# Altium schematic sheet Buttons.SchDoc
size A4; SheetNumber: 4; SheetTotal: 4
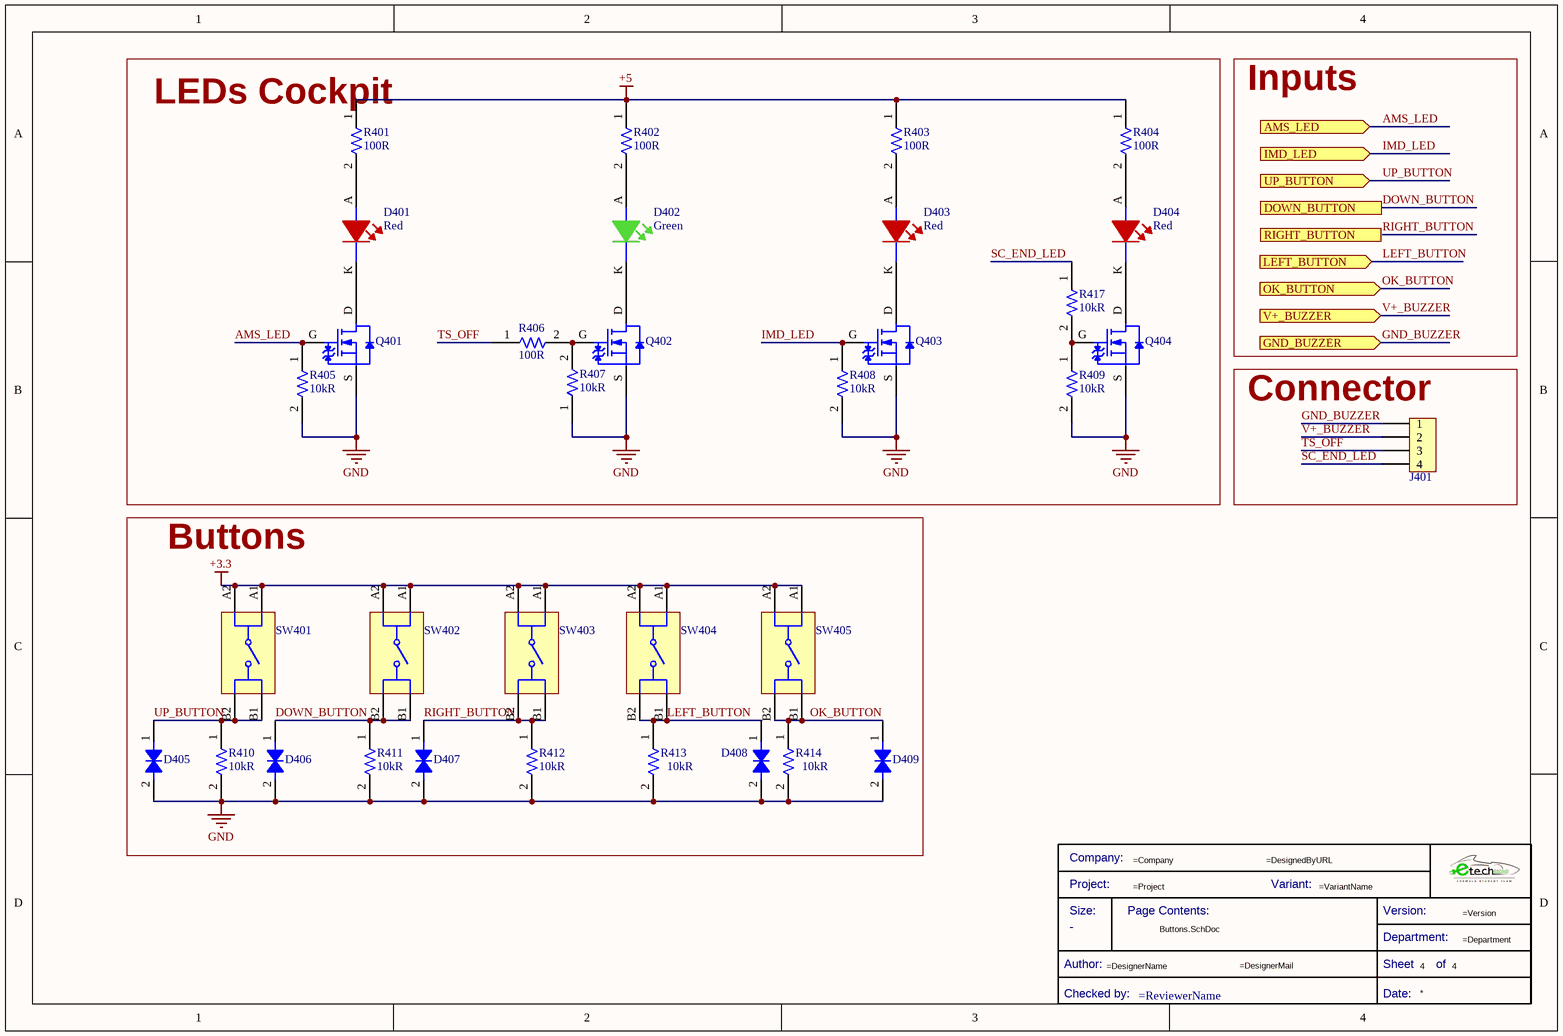
[diagram p0: Buttons.SchDoc]

## Parts
*  Title Block_template  (value not drawn)  (graphical)
D401  Color: Red  [LED-THT/WE/D3.9H10.5]  (hidden comment: 150080RS75000)
D402  Color: Green  [LED-THT/WE/D3.9H10.5]  (hidden comment: 150080GS75000)
D403  Color: Red  [LED-THT/WE/D3.9H10.5]  (hidden comment: 150080RS75000)
D404  Color: Red  [LED-THT/WE/D3.9H10.5]  (hidden comment: 150080RS75000)
D405  824501600  [DTVS-DO-214AC]  (value not drawn)
D406  824501600  [DTVS-DO-214AC]  (value not drawn)
D407  824501600  [DTVS-DO-214AC]  (value not drawn)
D408  824501600  [DTVS-DO-214AC]  (value not drawn)
D409  824501600  [DTVS-DO-214AC]  (value not drawn)
J401  436500400  [J_MicroFit_1x4]  (value not drawn)
Q401  SQ2318BES-T1_GE3  [TRT-NCH-3/35-CPH]  (value not drawn)
Q402  SQ2318BES-T1_GE3  [TRT-NCH-3/35-CPH]  (value not drawn)
Q403  SQ2318BES-T1_GE3  [TRT-NCH-3/35-CPH]  (value not drawn)
Q404  SQ2318BES-T1_GE3  [TRT-NCH-3/35-CPH]  (value not drawn)
R401  Resistance: 100R  [R0805FTK]  (hidden comment: CR0805-FX-1000ELF)
R402  Resistance: 100R  [R0805FTK]  (hidden comment: CR0805-FX-1000ELF)
R403  Resistance: 100R  [R0805FTK]  (hidden comment: CR0805-FX-1000ELF)
R404  Resistance: 100R  [R0805FTK]  (hidden comment: CR0805-FX-1000ELF)
R405  Resistance: 10kR  [R0805FTK]  (hidden comment: CR0805-JW-103ELF)
R406  Resistance: 100R  [R0805FTK]  (hidden comment: CR0805-FX-1000ELF)
R407  Resistance: 10kR  [R0805FTK]  (hidden comment: CR0805-JW-103ELF)
R408  Resistance: 10kR  [R0805FTK]  (hidden comment: CR0805-JW-103ELF)
R409  Resistance: 10kR  [R0805FTK]  (hidden comment: CR0805-JW-103ELF)
R410  Resistance: 10kR  [R0805FTK]  (hidden comment: CR0805-JW-103ELF)
R411  Resistance: 10kR  [R0805FTK]  (hidden comment: CR0805-JW-103ELF)
R412  Resistance: 10kR  [R0805FTK]  (hidden comment: CR0805-JW-103ELF)
R413  Resistance: 10kR  [R0805FTK]  (hidden comment: CR0805-JW-103ELF)
R414  Resistance: 10kR  [R0805FTK]  (hidden comment: CR0805-JW-103ELF)
R417  Resistance: 10kR  [R0805FTK]  (hidden comment: CR0805-JW-104ELF)
SW401  430456073736  [SWITCH_12x12/4304x60737x6]  (value not drawn)
SW402  430456073736  [SWITCH_12x12/4304x60737x6]  (value not drawn)
SW403  430456073736  [SWITCH_12x12/4304x60737x6]  (value not drawn)
SW404  430456073736  [SWITCH_12x12/4304x60737x6]  (value not drawn)
SW405  430456073736  [SWITCH_12x12/4304x60737x6]  (value not drawn)

## Blocks framed on the sheet
LEDs Cockpit: D401-D404 Q401-Q404 R401-R409 R417
Connector: J401
Buttons: D405-D409 R410-R414 SW401-SW405

## Ports
AMS_LED (in, see DASHBOARD[1C]), DOWN_BUTTON (in, see DASHBOARD[1C]), GND_BUZZER (in, see DASHBOARD[1C]), IMD_LED (in, see DASHBOARD[1C]), LEFT_BUTTON (in, see DASHBOARD[1C]), OK_BUTTON (in, see DASHBOARD[1C]), RIGHT_BUTTON (in, see DASHBOARD[1C]), UP_BUTTON (in, see DASHBOARD[1C]), V+_BUZZER (in, see DASHBOARD[1C])

## Nets
+3.3: SW401.A1 SW401.A2 SW402.A1 SW402.A2 SW403.A1 SW403.A2 SW404.A1 SW404.A2 SW405.A1 SW405.A2
+5: R401.1 R402.1 R403.1 R404.1
GND: D405.2 D406.2 D407.2 D408.2 D409.2 Q401.S Q402.S Q403.S Q404.S R405.2 R407.1 R408.2 R409.2 R410.2 R411.2 R412.2 R413.2 R414.2
AMS_LED: Q401.G R405.1 ; port AMS_LED
DOWN_BUTTON: D406.1 R411.1 SW402.B1 SW402.B2
GND_BUZZER: J401.1 ; port GND_BUZZER
IMD_LED: Q403.G R408.1 ; port IMD_LED
LEFT_BUTTON: D408.1 R413.1 SW404.B1 SW404.B2 ; port LEFT_BUTTON
OK_BUTTON: D409.1 R414.1 SW405.B1 SW405.B2 ; port OK_BUTTON
RIGHT_BUTTON: D407.1 R412.1 SW403.B1 SW403.B2
SC_END_LED: J401.4 R417.1
TS_OFF: J401.3 R406.1
UP_BUTTON: D405.1 R410.1 SW401.B1 SW401.B2 ; port UP_BUTTON
V+_BUZZER: J401.2 ; port V+_BUZZER
NetD401_A: D401.A R401.2
NetD401_K: D401.K Q401.D
NetD402_A: D402.A R402.2
NetD402_K: D402.K Q402.D
NetD403_A: D403.A R403.2
NetD403_K: D403.K Q403.D
NetD404_A: D404.A R404.2
NetD404_K: D404.K Q404.D
NetQ402_G: Q402.G R406.2 R407.2
NetQ404_G: Q404.G R409.1 R417.2

## Notes on the sheet
- Inputs
- (in symbol Title Block_template) Company:; Project:; Variant:; Size:; Page Contents:; Version:; Department:; Author:; Sheet; of; Checked by:; Date:

## Library data of the parts
* = Title Block_template: Standard Title Block; .Creator: GP; Category: Title Block; .PCBcheck: GP; .SCHcheck: GP; Checked by:: =ReviewerName; Size: -
D401 D403 D404 = LEDRS-THT: 0805(H=0.8mm) 红色 高亮 λD=625nm VF=2V IF=30mA PD=72mW; Manufacturer 1: Wurth Electronics; Luminous Intensity: 150mcd; Viewing Angle: 140°; Forward Voltage: 2V; Wavelength: 625nm; Lens Style: Clear,Rectangular; Forward Current: 30mA; Test Current: 20mA; .Creator: DR; ComponentLink1Description: Datasheet; ComponentLink1URL: https://www.we-online.com/catalog/datasheet/150080RS75000.pdf; ComponentLink2Description: Where buy it; ComponentLink2URL: https://katalog.we-online.de/en/led/WL-SMCW/150080RS75000; Supplier 1: RSComponents; Manufacturer Part Number 1: 150080RS75000; RoHS: Yes; Category: LEDs; Stock 1: 1; Pricing 1: 50=0,19300, 500=0,12900, 1000=0,12300, 2000=0,11700, 4000=0,11100 (USD); Mount: Surface Mount; Case/Package: 0805; Case Code (Metric): 2012; Case Code (Imperial): 0805; Min Operating Temperature: -40°C; Max Operating Temperature: 85°C; Package Quantity: 4000; Packaging: Tape and Reel; Dominant Wavelength: 625nm; Length: 2mm; Width: 1.25mm; Height: 0.7mm; REACH SVHC: Unknown; RoHS Compliant: Yes; ComponentLink3URL: https://datasheet.ciiva.com/22656/150080rs75000-22656961.pdf?src-supplier=Element14; ComponentLink3Description: https://datasheet.ciiva.com/22656/150080rs75000-22656961.pdf?src-supplier=Element14; ComponentLink4URL: https://datasheet.ciiva.com/29279/759435-da-01-en-chipled-0805-w-kl-rot-150080rs75000-29279032.pdf?src-supplier=Conrad; ComponentLink4Description: https://datasheet.ciiva.com/29279/759435-da-01-en-chipled-0805-w-kl-rot-150080rs75000-29279032.pdf?src-supplier=Conrad; Supplier Part Number 1: 8154225P
D402 = LEDGS-THT: Led, Green, 520 Nm, 3.2 V, 30 Ma, 450 Mcd Rohs Compliant: Yes; Manufacturer 1: Wurth Electronics; Viewing Angle: 140°; Lens Style: Clear,Rectangular; Luminous Intensity: 450mcd; Forward Voltage: 3.2V; Wavelength: 520nm; Forward Current: 30mA; Test Current: 20mA; .Creator: GP; ComponentLink1Description: Datasheet; ComponentLink1URL: https://www.we-online.com/catalog/datasheet/150080GS75000.pdf; ComponentLink2Description: Where buy it; ComponentLink2URL: https://katalog.we-online.de/en/led/WL-SMCW/150080GS75000; Supplier 1: RSComponents; Manufacturer Part Number 1: 150080GS75000; RoHS: Yes; Category: LEDs; Stock 1: 4350; Pricing 1: 50=0,19300, 500=0,12900, 1000=0,12300, 2000=0,11700, 4000=0,11100 (USD); Mount: Surface Mount; Case/Package: 0805; Case Code (Metric): 2012; Case Code (Imperial): 0805; Min Operating Temperature: -40°C; Max Operating Temperature: 85°C; Package Quantity: 4000; Packaging: Cut Tape; Dominant Wavelength: 520nm; Length: 2mm; Width: 1.25mm; Height: 0.7mm; REACH SVHC: Unknown; RoHS Compliant: Yes; ComponentLink3URL: https://datasheet.ciiva.com/29563/150080gs75000-29563008.pdf?src-supplier=Digi-Key; ComponentLink3Description: https://datasheet.ciiva.com/29563/150080gs75000-29563008.pdf?src-supplier=Digi-Key; ComponentLink4URL: https://datasheet.ciiva.com/29279/759434-da-01-en-chipled-0805-w-kl-gruen-150080gs75000-29279039.pdf?src-supplier=Conrad; ComponentLink4Description: https://datasheet.ciiva.com/29279/759434-da-01-en-chipled-0805-w-kl-gruen-150080gs75000-29279039.pdf?src-supplier=Conrad; Supplier Part Number 1: 8154221
D405-D409 = DTVS-6V-DO-214AC: TVS diode [Würth Elektronik] 824501600 TVS diode; Manufacturer: Wurth Electronics; Number of Bidirectional Channels: 1; Reverse Standoff Voltage: 6V; Min Breakdown Voltage: 7.02V; Clamping Voltage: 10.3V; Peak Pulse Power: 400W; Power Line Protection: No; Polarity: Bidirectional; Peak Pulse Current: 38.8A; .Creator: DO; ComponentLink1Description: Where buy it; ComponentLink1URL: https://www.we-online.com/catalog/en/WE-TVSP?sq=824501600#824501600; Supplier 1: Mouser; Manufacturer Part Number: 824501600; RoHS: Yes; Category: TVS Diodes; Stock 1: 780; Pricing 1: 1=0,28000, 10=0,26100, 50=0,26100, 100=0,23400, 500=0,20400, 1000=0,17400, 10000=0,17400 (USD); Mount: Surface Mount; Number of Pins: 2; Min Operating Temperature: -65°C; Max Operating Temperature: 150°C; Packaging: Cut Tape; Max Breakdown Voltage: 7.02V; Resistor Type: Zener; REACH SVHC: Unknown; RoHS Compliant: Yes; ComponentLink2URL: http://www.farnell.com/datasheets/2036401.pdf?src-supplier=Element14; ComponentLink2Description: http://www.farnell.com/datasheets/2036401.pdf?src-supplier=Element14; Supplier Part Number 1: 710-824501600; ComponentLink3URL: https://katalog.we-online.de/pbs/datasheet/824501600.pdf?src-supplier=Digi-Key; ComponentLink3Description: https://katalog.we-online.de/pbs/datasheet/824501600.pdf?src-supplier=Digi-Key
J401 = J_MicroFit_1x4: Connector Wire to Board Header 4 Position 3mm Solder Right Angle Thru-Hole Tray; Manufacturer 1: Molex; Manufacturer Part Number 1: 43650-0400; Current Rating: 5A; Voltage Rating: 600V; Contact Resistance: 10mR; Connector Type: Plug; Number of Positions: 4; Gender: Male; Voltage Rating (DC): 250V; Glow Wire Compliant: Compliant; Supplier 1: Farnell; RoHS: Yes; Category: Headers and Wire Housings; Stock 1: 4623; Pricing 1: 1=1,24000, 10=1,22000, 50=1,19000, 100=1,17000, 500=1,14000, 1000=1,12000 (EUR); Mount: Through Hole,Cable; Contact Material: Brass,Copper Alloy; Contact Plating: Tin; Color: Black; Housing Color: Black; Housing Material: Thermoplastic; Min Operating Temperature: -40°C; Max Operating Temperature: 105°C; Termination: Solder; Orientation: Right Angle; Number of Rows: 1; Packaging: Tray; Package Quantity: 2380; Number of Contacts: 4; Max Voltage Rating (AC): 600V; Number of Circuits: 4; Series: 43650; Length: 14.86mm; Height: 4.5mm; Pitch: 3mm; Depth: 3.6mm; Radiation Hardening: No; Halogen Free: Low Halogen; Lead Free: Contains Lead; Flammability Rating: UL94 V-0; RoHS Compliant: Yes; ComponentLink1URL: https://datasheet.ciiva.com/19462/884184-19462234.pdf?src-supplier=Jameco; ComponentLink1Description: https://datasheet.ciiva.com/19462/884184-19462234.pdf?src-supplier=Jameco; ComponentLink2URL: https://datasheet.ciiva.com/5151/0436500400-pcb-headers-148663-5151881.pdf?src-supplier=Mouser; ComponentLink2Description: https://datasheet.ciiva.com/5151/0436500400-pcb-headers-148663-5151881.pdf?src-supplier=Mouser; ComponentLink3URL: https://datasheet.ciiva.com/16085/0436500400-pcb-headers-16085752.pdf?src-supplier=Onlinecomponents.com; ComponentLink3Description: https://datasheet.ciiva.com/16085/0436500400-pcb-headers-16085752.pdf?src-supplier=Onlinecomponents.com; ComponentLink4URL: https://datasheet.ciiva.com/11748/0900766b80d6135b-11748178.pdf?src-supplier=RSComponents; ComponentLink4Description: https://datasheet.ciiva.com/11748/0900766b80d6135b-11748178.pdf?src-supplier=RSComponents; ComponentLink5URL: https://datasheet.ciiva.com/30221/142510436500400-pcb-headers-30221164.pdf?src-supplier=Onlinecomponents.com; ComponentLink5Description: https://datasheet.ciiva.com/30221/142510436500400-pcb-headers-30221164.pdf?src-supplier=Onlinecomponents.com; ComponentLink6URL: https://datasheet.ciiva.com/17080/70266896-17080471.pdf?src-supplier=Allied+Electronics; ComponentLink6Description: https://datasheet.ciiva.com/17080/70266896-17080471.pdf?src-supplier=Allied+Electronics; ComponentLink7URL: https://datasheet.ciiva.com/7094/1946229-7094763.pdf?src-supplier=Newark; ComponentLink7Description: https://datasheet.ciiva.com/7094/1946229-7094763.pdf?src-supplier=Newark; ComponentLink8URL: https://datasheet.ciiva.com/9449/0436500400-pcb-headers-9449446.pdf?src-supplier=Avnet; ComponentLink8Description: https://datasheet.ciiva.com/9449/0436500400-pcb-headers-9449446.pdf?src-supplier=Avnet; Supplier Part Number 1: 1012232
Q401-Q404 = TRT-NCH-8/40-SQ: Automotive N-channel 40 V (d-s) 175C Mosfet SOT-23; Manufacturer 1: Vishay; Id: 8A; Vds: 40V; .Creator: DO; Supplier 1: Newark; Manufacturer Part Number 1: SQ2318BES-T1_GE3; RoHS: No; Pricing 1: 1=0,71500, 5=0,71500, 10=0,64400, 25=0,59000, 50=0,52500, 100=0,47100, 250=0,40800 (USD); Supplier Part Number 1: 81AH9290; ComponentLink1Description: Where to buy; ComponentLink1URL: https://www.mouser.es/ProductDetail/Vishay-Siliconix/SQ2318BES-T1_GE3?qs=sPbYRqrBIVmyZcxPsDt0vA%3D%3D; ComponentLink2Description: Datasheet; ComponentLink2URL: https://www.mouser.es/datasheet/2/427/sq2318bes-1868475.pdf
R401-R404 R406 = R100-0805FTK: Res Thick Film 0805 100 Ohm 1% 1/8W ±100ppm/°C Molded SMD SMD Paper Tape on Plastic Reel; Manufacturer 1: Bourns; Power Rating: 125mW; Voltage Rating: 150V; .Creator: DR; Supplier 1: Arrow Electronics; Manufacturer Part Number 1: CR0805-FX-1000ELF; RoHS: Yes; Category: Chip SMD Resistors; Stock 1: 49802; Pricing 1: 1=0,05840, 10=0,03430, 25=0,01780, 100=0,00750, 250=0,00560, 500=0,00490, 3000=0,00470 (USD); Mount: Surface Mount; Case/Package: 0805; Number of Pins: 2; Contact Plating: Tin; Case Code (Imperial): 0805; Case Code (Metric): 2012; Min Operating Temperature: -55°C; Max Operating Temperature: 155°C; Tolerance: 1%; Resistor Type: Thick Film; Temperature Coefficient: 100ppm/°C; Packaging: Tape and Reel; Package Quantity: 1; Termination: SMD/SMT; Number of Terminations: 2; Max Power Dissipation: 125mW; Voltage Rating (DC): 150V; Features: Moisture Resistant; Series: CR0805; Resistance Tolerance: 1%; Construction: Rectangular; Technology: THICK FILM; Length: 2mm; Width: 1.25mm; Height: 0.5mm; Depth: 1.25mm; Thickness: 508um; Radiation Hardening: No; REACH SVHC: No SVHC; Military Standard: Not; RoHS Compliant: Yes; ComponentLink1URL: https://datasheet.ciiva.com/11809/0900766b80fcdb72-11809178.pdf?src-supplier=RSComponents; ComponentLink1Description: https://datasheet.ciiva.com/11809/0900766b80fcdb72-11809178.pdf?src-supplier=RSComponents; ComponentLink2URL: https://datasheet.ciiva.com/6547/chpreztr-6547413.pdf?src-supplier=Digi-Key; ComponentLink2Description: https://datasheet.ciiva.com/6547/chpreztr-6547413.pdf?src-supplier=Digi-Key; ComponentLink3URL: https://datasheet.ciiva.com/6547/chpreztr-6547414.pdf?src-supplier=Digi-Key; ComponentLink3Description: https://datasheet.ciiva.com/6547/chpreztr-6547414.pdf?src-supplier=Digi-Key; ComponentLink4URL: https://datasheet.ciiva.com/6547/chpreztr-6547415.pdf?src-supplier=Digi-Key; ComponentLink4Description: https://datasheet.ciiva.com/6547/chpreztr-6547415.pdf?src-supplier=Digi-Key; ComponentLink5URL: https://datasheet.ciiva.com/9120/chpreztr-9120744.pdf?src-supplier=Avnet; ComponentLink5Description: https://datasheet.ciiva.com/9120/chpreztr-9120744.pdf?src-supplier=Avnet; Supplier Part Number 1: CR0805-FX-1000ELF
R405 R407-R414 R417 = R10k-0805FTK: BOURNS         CR0805-JW-103ELF            Surface Mount Chip Resistor, Thick Film, CR Series, 10 kohm, 125 mW,  5%, 150 V; Temperature Coefficient: 200ppm/°C; Power Rating: 125mW; Voltage Rating: 150V; Voltage Rating (DC): 100V; .Creator: DR; Supplier 1: Arrow Electronics; Manufacturer 1: Bourns; Manufacturer Part Number 1: CR0805-JW-103ELF; RoHS: Yes; Category: Chip SMD Resistors; Stock 1: 57566; Pricing 1: 1=0,05790, 10=0,01540, 25=0,01340, 100=0,00340 (USD); Mount: Surface Mount; Case/Package: 0805; Number of Pins: 2; Contact Plating: Tin; Case Code (Metric): 2012; Case Code (Imperial): 0805; Min Operating Temperature: -55°C; Max Operating Temperature: 155°C; Tolerance: 5%; Resistor Type: Thick Film; Package Quantity: 1; Packaging: Tape and Reel; Number of Terminations: 2; Termination: SMD/SMT; Max Power Dissipation: 125mW; Features: Moisture Resistant; Series: CR0805; Construction: Rectangular; Resistance Tolerance: 5%; Technology: THICK FILM; Length: 2mm; Width: 1.25mm; Height: 0.5mm; Depth: 1.25mm; Thickness: 508um; Radiation Hardening: No; REACH SVHC: No SVHC; Military Standard: Not; RoHS Compliant: Yes; ComponentLink1URL: https://datasheet.ciiva.com/11821/0900766b80fcdb72-11821135.pdf?src-supplier=RSComponents; ComponentLink1Description: https://datasheet.ciiva.com/11821/0900766b80fcdb72-11821135.pdf?src-supplier=RSComponents; ComponentLink2URL: https://datasheet.ciiva.com/9122/chpreztr-9122374.pdf?src-supplier=Avnet; ComponentLink2Description: https://datasheet.ciiva.com/9122/chpreztr-9122374.pdf?src-supplier=Avnet; ComponentLink3URL: https://datasheet.ciiva.com/22693/1902866-22693254.pdf?src-supplier=Element14; ComponentLink3Description: https://datasheet.ciiva.com/22693/1902866-22693254.pdf?src-supplier=Element14; ComponentLink4URL: https://datasheet.ciiva.com/7986/691949-7986187.pdf?src-supplier=Element14; ComponentLink4Description: https://datasheet.ciiva.com/7986/691949-7986187.pdf?src-supplier=Element14; ComponentLink5URL: https://datasheet.ciiva.com/30065/159chpreztr-30065976.pdf?src-supplier=Onlinecomponents.com; ComponentLink5Description: https://datasheet.ciiva.com/30065/159chpreztr-30065976.pdf?src-supplier=Onlinecomponents.com; ComponentLink6URL: https://datasheet.ciiva.com/16783/70154685-16783482.pdf?src-supplier=Allied+Electronics; ComponentLink6Description: https://datasheet.ciiva.com/16783/70154685-16783482.pdf?src-supplier=Allied+Electronics; ComponentLink7URL: https://datasheet.ciiva.com/5548/chpreztr-5548491.pdf?src-supplier=Mouser; ComponentLink7Description: https://datasheet.ciiva.com/5548/chpreztr-5548491.pdf?src-supplier=Mouser; ComponentLink8URL: https://datasheet.ciiva.com/6559/chpreztr-6559900.pdf?src-supplier=Digi-Key; ComponentLink8Description: https://datasheet.ciiva.com/6559/chpreztr-6559900.pdf?src-supplier=Digi-Key; ComponentLink9URL: https://datasheet.ciiva.com/6559/chpreztr-6559901.pdf?src-supplier=Digi-Key; ComponentLink9Description: https://datasheet.ciiva.com/6559/chpreztr-6559901.pdf?src-supplier=Digi-Key; ComponentLink10URL: https://datasheet.ciiva.com/7985/1856384-7985869.pdf?src-supplier=Element14; ComponentLink10Description: https://datasheet.ciiva.com/7985/1856384-7985869.pdf?src-supplier=Element14; ComponentLink11URL: https://datasheet.ciiva.com/48692/001055517-da-01-en-smd-wid-cr0805-jw-103elf-10k-ohm-1-8w-48692118.pdf?src-supplier=Conrad; ComponentLink11Description: https://datasheet.ciiva.com/48692/001055517-da-01-en-smd-wid-cr0805-jw-103elf-10k-ohm-1-8w-48692118.pdf?src-supplier=Conrad; Supplier Part Number 1: CR0805-JW-103ELF
SW401-SW405 = Switch_THT_NO/430456073736: WS-TATV THT Washable Tact Switch 12x12mm, SPST-NO, 12VDC, 50mA, 360g; Supplier 1: Rs; Supplier Part Number 1: 7856320